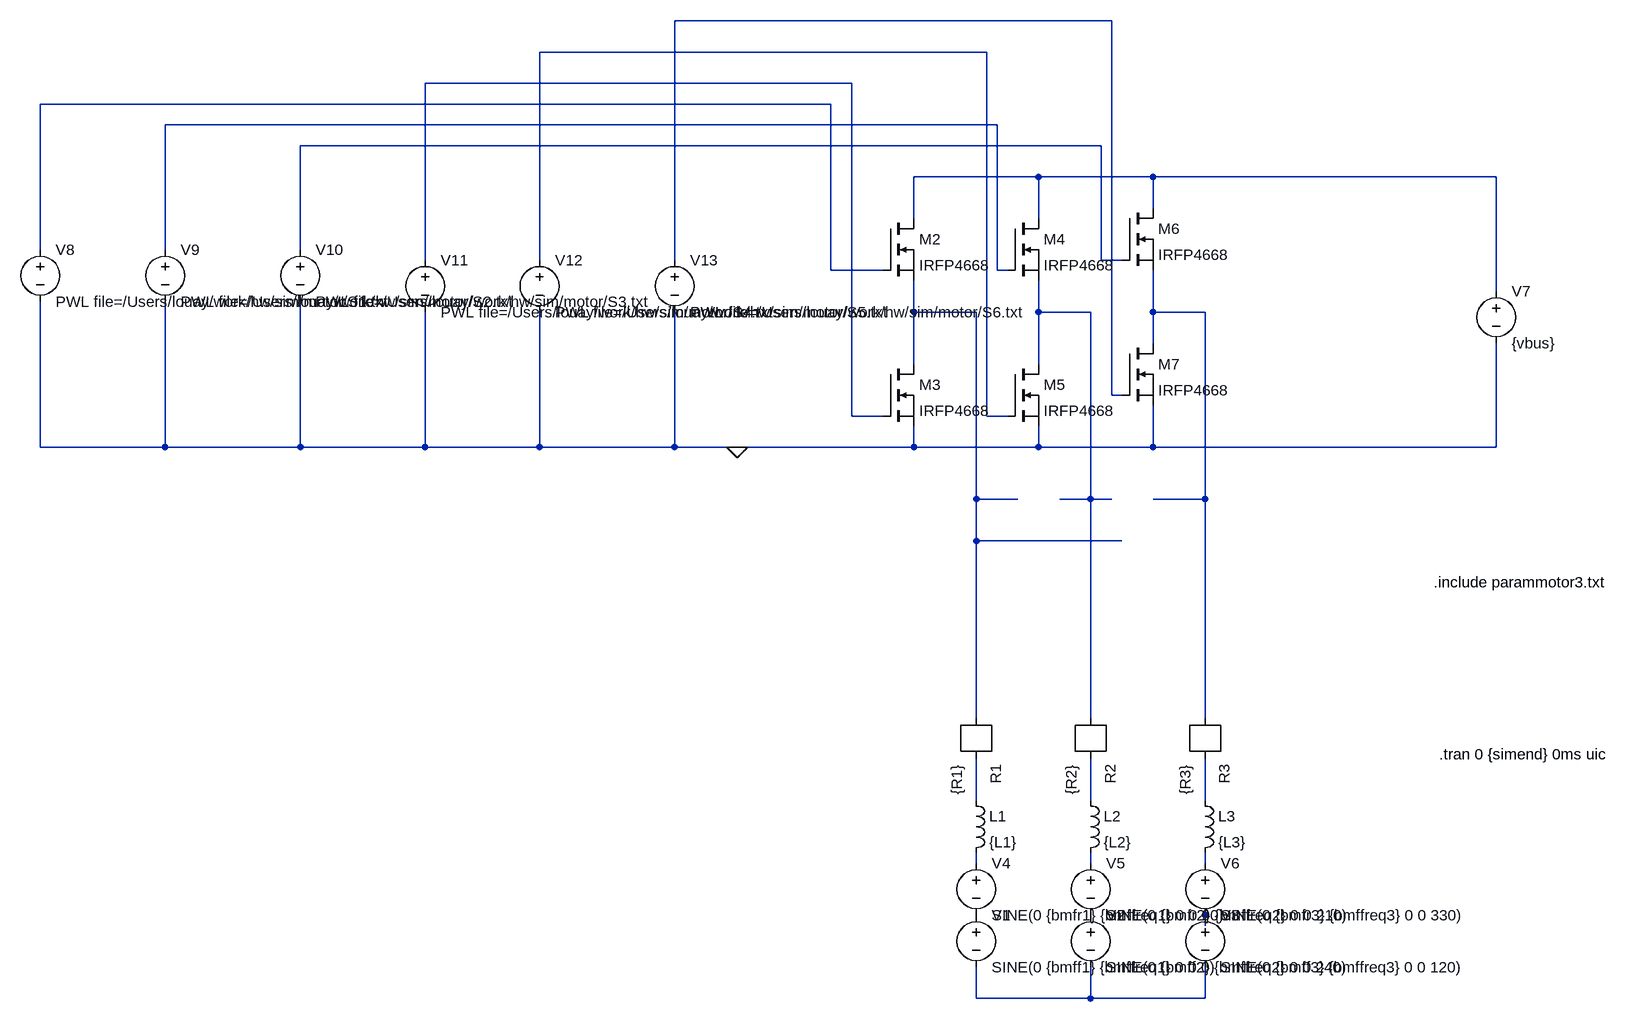
[diagram p0: schematic motor3.asc]
motor3.asc, the LTspice schematic file:
Version 4
SHEET 1 1408 680
WIRE 576 -1088 -96 -1088
WIRE 384 -1040 -304 -1040
WIRE 176 -992 -480 -992
WIRE 144 -960 -1072 -960
WIRE 400 -928 -880 -928
WIRE 560 -896 -672 -896
WIRE 464 -848 272 -848
WIRE 640 -848 464 -848
WIRE 1168 -848 640 -848
WIRE 640 -800 640 -848
WIRE 272 -784 272 -848
WIRE 464 -784 464 -848
WIRE -1072 -736 -1072 -960
WIRE -880 -736 -880 -928
WIRE -672 -736 -672 -896
WIRE -480 -720 -480 -992
WIRE -304 -720 -304 -1040
WIRE -96 -720 -96 -1088
WIRE 560 -720 560 -896
WIRE 592 -720 560 -720
WIRE 144 -704 144 -960
WIRE 224 -704 144 -704
WIRE 400 -704 400 -928
WIRE 416 -704 400 -704
WIRE 1168 -672 1168 -848
WIRE 272 -640 272 -688
WIRE 368 -640 272 -640
WIRE 464 -640 464 -688
WIRE 544 -640 464 -640
WIRE 640 -640 640 -704
WIRE 720 -640 640 -640
WIRE 640 -592 640 -640
WIRE 272 -560 272 -640
WIRE 464 -560 464 -640
WIRE 576 -512 576 -1088
WIRE 592 -512 576 -512
WIRE 176 -480 176 -992
WIRE 224 -480 176 -480
WIRE 384 -480 384 -1040
WIRE 416 -480 384 -480
WIRE -1072 -432 -1072 -656
WIRE -880 -432 -880 -656
WIRE -880 -432 -1072 -432
WIRE -672 -432 -672 -656
WIRE -672 -432 -880 -432
WIRE -480 -432 -480 -640
WIRE -480 -432 -672 -432
WIRE -304 -432 -304 -640
WIRE -304 -432 -480 -432
WIRE -96 -432 -96 -640
WIRE -96 -432 -304 -432
WIRE 0 -432 -96 -432
WIRE 272 -432 272 -464
WIRE 272 -432 0 -432
WIRE 464 -432 464 -464
WIRE 464 -432 272 -432
WIRE 640 -432 640 -496
WIRE 640 -432 464 -432
WIRE 1168 -432 1168 -592
WIRE 1168 -432 640 -432
WIRE 368 -352 368 -640
WIRE 432 -352 368 -352
WIRE 544 -352 544 -640
WIRE 544 -352 496 -352
WIRE 576 -352 544 -352
WIRE 720 -352 720 -640
WIRE 720 -352 640 -352
WIRE 368 -288 368 -352
WIRE 592 -288 368 -288
WIRE 368 -16 368 -288
WIRE 544 -16 544 -352
WIRE 720 -16 720 -352
WIRE 368 112 368 48
WIRE 544 112 544 48
WIRE 720 112 720 48
WIRE 368 208 368 192
WIRE 544 208 544 192
WIRE 720 208 720 192
WIRE 720 304 720 288
WIRE 368 416 368 368
WIRE 544 416 544 368
WIRE 544 416 368 416
WIRE 720 416 720 368
WIRE 720 416 544 416
FLAG 0 -432 0
SYMBOL voltage 368 272 R0
SYMATTR InstName V1
SYMATTR Value SINE(0 {bmff1} {bmffreq1} 0 0 0)
SYMBOL voltage 544 272 R0
SYMATTR InstName V2
SYMATTR Value SINE(0 {bmff2} {bmffreq2} 0 0 240)
SYMBOL voltage 720 272 R0
SYMATTR InstName V3
SYMATTR Value SINE(0 {bmff3} {bmffreq3} 0 0 120)
SYMBOL r 368 -16 R90
SYMATTR InstName R1
SYMATTR Value {R1}
SYMBOL r 544 -16 R90
SYMATTR InstName R2
SYMATTR Value {R2}
SYMBOL r 720 -16 R90
SYMATTR InstName R3
SYMATTR Value {R3}
SYMBOL ind 352 96 R0
SYMATTR InstName L1
SYMATTR Value {L1}
SYMBOL ind 528 96 R0
SYMATTR InstName L2
SYMATTR Value {L2}
SYMBOL ind 704 96 R0
SYMATTR InstName L3
SYMATTR Value {L3}
SYMBOL voltage 368 192 R0
SYMATTR InstName V4
SYMATTR Value SINE(0 {bmfr1} {bmffreq1} 0 0 90)
SYMBOL voltage 544 192 R0
SYMATTR InstName V5
SYMATTR Value SINE(0 {bmfr2} {bmffreq2} 0 0 210)
SYMBOL voltage 720 192 R0
SYMATTR InstName V6
SYMATTR Value SINE(0 {bmfr3} {bmffreq3} 0 0 330)
SYMBOL nmos 224 -784 R0
SYMATTR InstName M2
SYMATTR Value IRFP4668
SYMBOL nmos 224 -560 R0
SYMATTR InstName M3
SYMATTR Value IRFP4668
SYMBOL nmos 416 -784 R0
SYMATTR InstName M4
SYMATTR Value IRFP4668
SYMBOL nmos 416 -560 R0
SYMATTR InstName M5
SYMATTR Value IRFP4668
SYMBOL nmos 592 -800 R0
SYMATTR InstName M6
SYMATTR Value IRFP4668
SYMBOL nmos 592 -592 R0
SYMATTR InstName M7
SYMATTR Value IRFP4668
SYMBOL voltage 1168 -688 R0
SYMATTR InstName V7
SYMATTR Value {vbus}
SYMATTR SpiceLine Rser=0.01
SYMBOL voltage -1072 -752 R0
SYMATTR InstName V8
SYMATTR Value PWL file=/Users/louay/work/hw/sim/motor/S1.txt
SYMBOL voltage -880 -752 R0
SYMATTR InstName V9
SYMATTR Value PWL file=/Users/louay/work/hw/sim/motor/S2.txt
SYMBOL voltage -672 -752 R0
SYMATTR InstName V10
SYMATTR Value PWL file=/Users/louay/work/hw/sim/motor/S3.txt
SYMBOL voltage -480 -736 R0
SYMATTR InstName V11
SYMATTR Value PWL file=/Users/louay/work/hw/sim/motor/S4.txt
SYMBOL voltage -304 -736 R0
SYMATTR InstName V12
SYMATTR Value PWL file=/Users/louay/work/hw/sim/motor/S5.txt
SYMBOL voltage -96 -736 R0
SYMATTR InstName V13
SYMATTR Value PWL file=/Users/louay/work/hw/sim/motor/S6.txt
TEXT 1080 40 Left 2 !.tran 0 {simend} 0ms uic
TEXT 1072 -224 Left 2 !.include parammotor3.txt

The netlist it stands for:
* motor3.asc
V1 P001 N018 SINE(0 {bmff1} {bmffreq1} 0 0 0)
V2 P002 N018 SINE(0 {bmff2} {bmffreq2} 0 0 240)
V3 N017 N018 SINE(0 {bmff3} {bmffreq3} 0 0 120)
R1 N011 N008 {R1}
R2 N012 N009 {R2}
R3 N013 N010 {R3}
L1 N011 N014 {L1}
L2 N012 N015 {L2}
L3 N013 N016 {L3}
V4 N014 P001 SINE(0 {bmfr1} {bmffreq1} 0 0 90)
V5 N015 P002 SINE(0 {bmfr2} {bmffreq2} 0 0 210)
V6 N016 N017 SINE(0 {bmfr3} {bmffreq3} 0 0 330)
M2 N007 N004 N008 N008 IRFP4668
M3 N008 N003 0 0 IRFP4668
M4 N007 N005 N009 N009 IRFP4668
M5 N009 N002 0 0 IRFP4668
M6 N007 N006 N010 N010 IRFP4668
M7 N010 N001 0 0 IRFP4668
V7 N007 0 {vbus} Rser=0.01
V8 N004 0 PWL file=/Users/louay/work/hw/sim/motor/S1.txt
V9 N005 0 PWL file=/Users/louay/work/hw/sim/motor/S2.txt
V10 N006 0 PWL file=/Users/louay/work/hw/sim/motor/S3.txt
V11 N003 0 PWL file=/Users/louay/work/hw/sim/motor/S4.txt
V12 N002 0 PWL file=/Users/louay/work/hw/sim/motor/S5.txt
V13 N001 0 PWL file=/Users/louay/work/hw/sim/motor/S6.txt
.model NMOS NMOS
.model PMOS PMOS
.lib standard.mos
.tran 0 {simend} 0ms uic
.include parammotor3.txt
.backanno
.end